# Altium schematic sheet 无线接收端.SchDoc
size A4
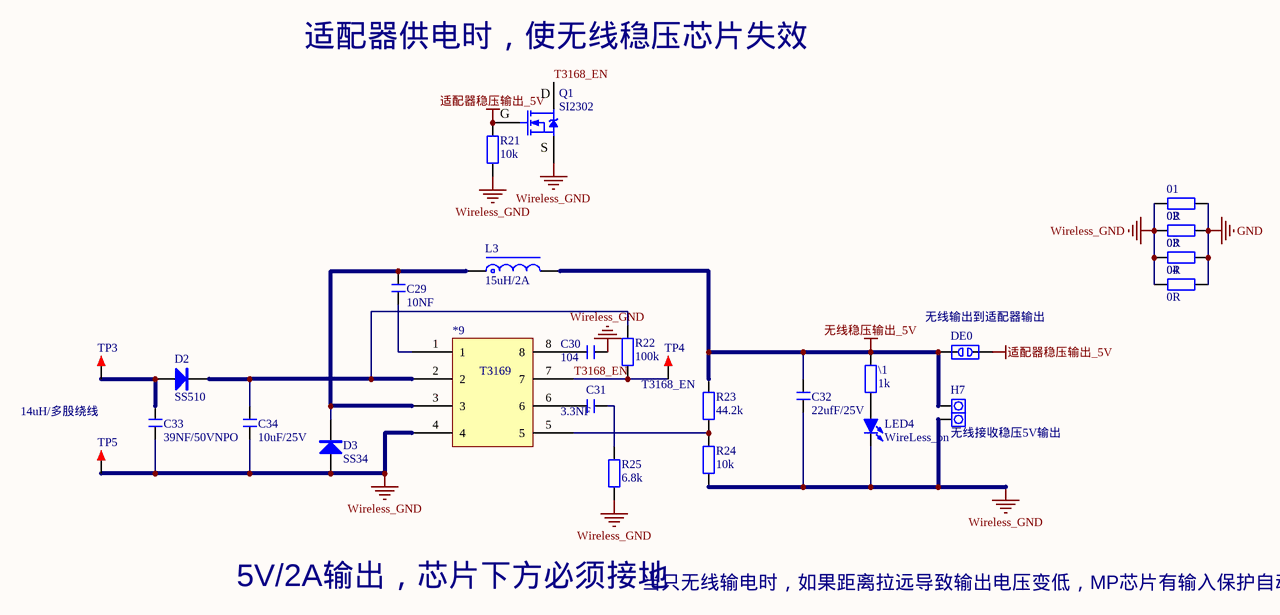
[diagram p0: 无线接收端.SchDoc]

## Parts
01  0R  [R 0805_M]
02  0R  [R 0805_M]
03  0R  [R 0805_M]
04  0R  [R 0805_M]
*9  T3169  [SOP8_M]
\1  1k  [R 0805_M]
C29  10NF  [C 0805_M]
C30  104  [C 0805_M]
C31  3.3NF  [C 0805_M]
C32  22ufF/25V  [C 0805_M]
C33  39NF/50VNPO  [C 0805_M]
C34  10uF/25V  [C 0805_M]
D2  SS510  [SMC]
D3  SS34  [SMA]
DE0  无线输出到适配器输出  [DEBUG_B]
H7  无线接收稳压5V输出  [PAD2-2.54]
L3  15uH/2A  [L-SMD-0630]
LED4  WireLess_on  [LED 0805G]
Q1  SI2302  [SOT23-3N]
R21  10k  [R 0805_M]
R22  100k  [R 0805_M]
R23  44.2k  [R 0805_M]
R24  10k  [R 0805_M]
R25  6.8k  [R 0805_M]
TP3  14uH/多股绕线  [TEST 2.0]
TP4  T3168_EN  [TEST 1]
TP5  14uH/多股绕线  [TEST 2.0]  (value not drawn)

## Nets
GND: 01.2 02.2 03.2 04.2
Wireless_GND: 01.1 02.1 03.1 04.1 *9.4 C30.1 C32.1 C33.1 C34.1 D3.1(A) H7.2 LED4.2(K) Q1.2(S) R21.2 R24.2 R25.1 TP5.1
无线稳压输出_5V: \1.2 C32.2 DE0.1 H7.1 L3.2 R23.1
适配器稳压输出_5V: DE0.2 Q1.1(G) R21.1
T3168_EN: *9.7 Q1.3(D) R22.1 TP4.1
Net*9_1: *9.1 C29.2
Net*9_2: *9.2 C34.2 D2.2(K) R22.2
Net*9_3: *9.3 C29.1 D3.2(K) L3.1
Net*9_5: *9.5 R23.2 R24.1
Net*9_6: *9.6 C31.2
Net*9_8: *9.8 C30.2
Ne~{t}1_1: \1.1 LED4.1(A)
NetC31_1: C31.1 R25.2
NetC33_2: C33.2 D2.1(A) TP3.1

## Notes on the sheet
- 适配器供电时，使无线稳压芯片失效
- 5V/2A输出，芯片下方必须接地
- 当只无线输电时，如果距离拉远导致输出电压变低，MP芯片有输入保护自动切换成电池升压输出模式

## Library data of the parts
01 02 03 04 \1 R21-R25 = R: 贴片电阻; 版权归属: 源创客; BOM名称: 贴片电阻; 学习资源: www.ooocke.com
*9 = 8
C29-C34 = C: 无极性贴片电容; 版权归属: 源创客; BOM名称: 无极性贴片电容; 学习资源: www.ooocke.com
D2 D3 = SS34: 肖特基二极管; 版权归属: 源创客; 属性: 40V/3A; BOM名称: 肖特基二极管; 学习资源: www.ooocke.com
DE0 = DEBUG: 调试断点焊盘; 版权归属: 源创客; BOM名称: 调试断点焊盘; 学习资源: www.ooocke.com
H7 = PAD2: 引线焊盘; 版权归属: 源创客; BOM名称: 引线焊盘; 学习资源: www.ooocke.com
L3 = L-CDRH: 功率屏蔽电感; 版权归属: 源创客; BOM名称: 功率屏蔽电感; 学习资源: www.ooocke.com
LED4 = LED-SMD: 贴片LED; 版权归属: 源创客; BOM名称: 贴片LED; 学习资源: www.ooocke.com
Q1 = SI2302: N沟道场效应管; 版权归属: 源创客; BOM名称: N沟道场效应管; 学习资源: www.ooocke.com
TP3-TP5 = TEST: 测试点; 版权归属: 源创客; BOM名称: 测试点; 学习资源: www.ooocke.com